# EAGLE design schematic (EAGLE 6.6.0)
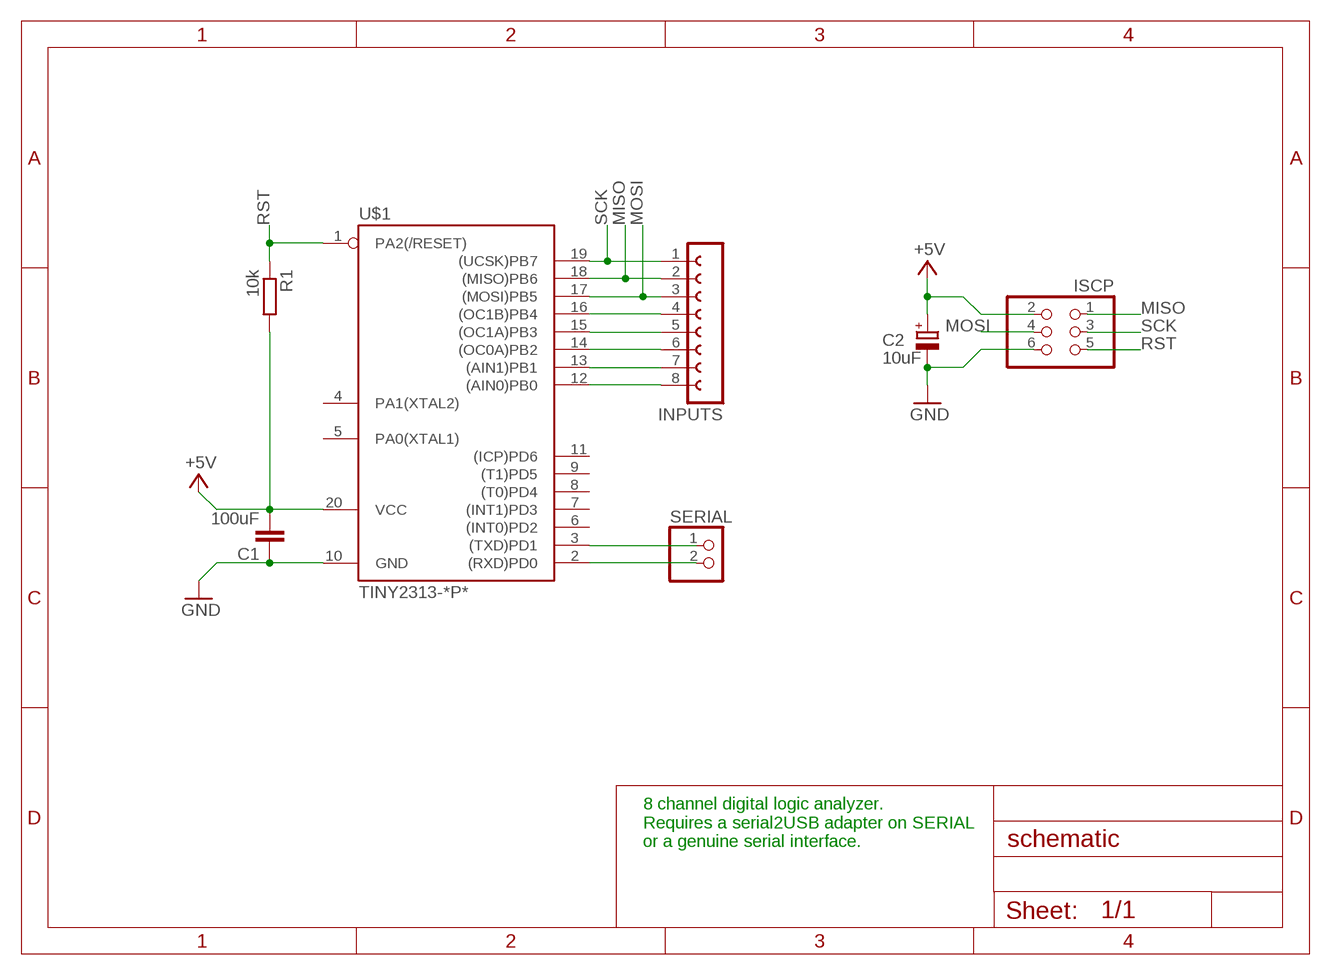
[diagram p0: schematic, sheet 1]

## Parts
C1  100uF  C-EU025-024X044  [C025-024X044]
C2  10uF  CPOL-EUE2.5-6  [E2,5-6]
INPUTS  FE08W  [FE08W]
ISCP  PINHD-2X3  [2X03]
R1  10k  R-EU_0204/2V  [0204V]
SERIAL  PINHD-1X2  [1X02]
U$1  TINY2313-*P*  [DIL20]

## Nets
+5V: C1.2 C2.+ ISCP.2 R1.2 U$1.20(VCC)
GND: C1.1 C2.- ISCP.6 U$1.10(GND)
MISO: INPUTS.2 ISCP.1 U$1.18((MISO)PB6)
MOSI: INPUTS.3 ISCP.4 U$1.17((MOSI)PB5)
N$1: SERIAL.1 U$1.3((TXD)PD1)
N$2: SERIAL.2 U$1.2((RXD)PD0)
N$4: INPUTS.4 U$1.16((OC1B)PB4)
N$5: INPUTS.5 U$1.15((OC1A)PB3)
N$6: INPUTS.6 U$1.14((OC0A)PB2)
N$7: INPUTS.7 U$1.13((AIN1)PB1)
N$8: INPUTS.8 U$1.12((AIN0)PB0)
RST: ISCP.5 R1.1 U$1.1(PA2(/RESET))
SCK: INPUTS.1 ISCP.3 U$1.19((UCSK)PB7)
Unconnected: U$1.4(PA1(XTAL2)) U$1.5(PA0(XTAL1)) U$1.6((INT0)PD2) U$1.7((INT1)PD3) U$1.8((T0)PD4) U$1.9((T1)PD5) U$1.11((ICP)PD6)

## Notes on the sheet
- 8 channel digital logic analyzer.
  Requires a serial2USB adapter on SERIAL
  or a genuine serial interface.

## Library data of the parts
C1 = rcl:C-EU: CAPACITOR, European symbol
C2 = rcl:CPOL-EU: POLARIZED CAPACITOR, European symbol
INPUTS = con-lsta:FE08W: FEMALE HEADER; OC_FARNELL: unknown; OC_NEWARK: unknown
ISCP = pinhead:PINHD-2X3: PIN HEADER
R1 = rcl:R-EU_: RESISTOR, European symbol
SERIAL = pinhead:PINHD-1X2: PIN HEADER
U$1 = avr-6:TINY2313*: Atmel Tiny2313 2K Flash, 128 bytes EEPROM, 128 bytes RAM

## Board
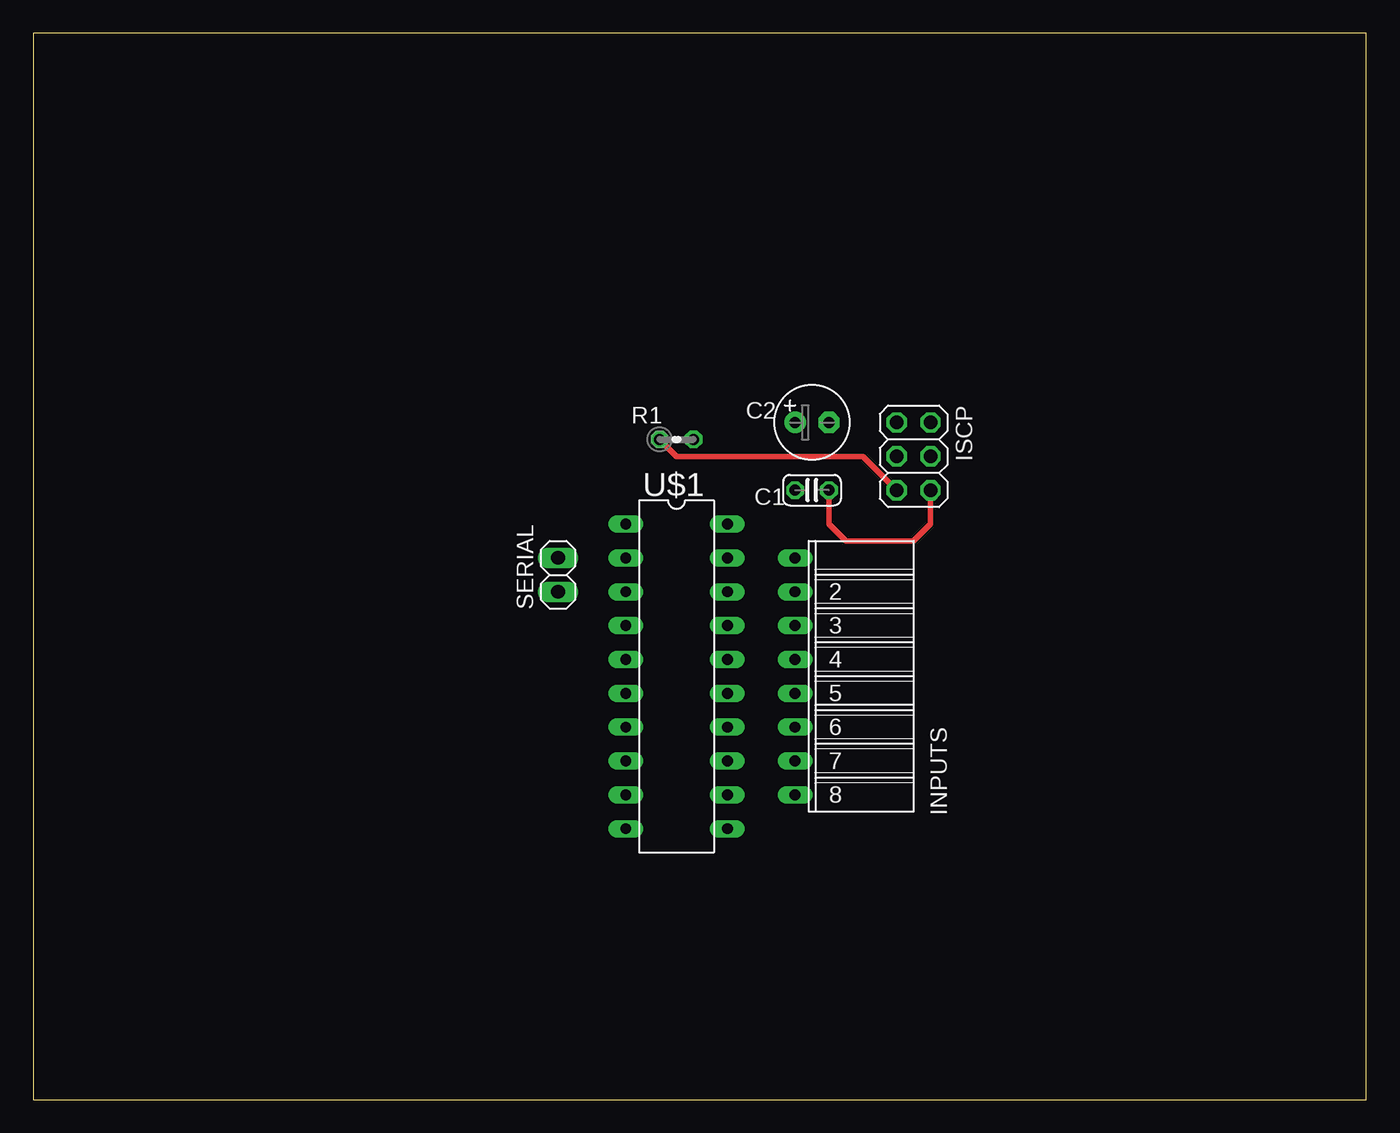
[diagram p1: board, top side]
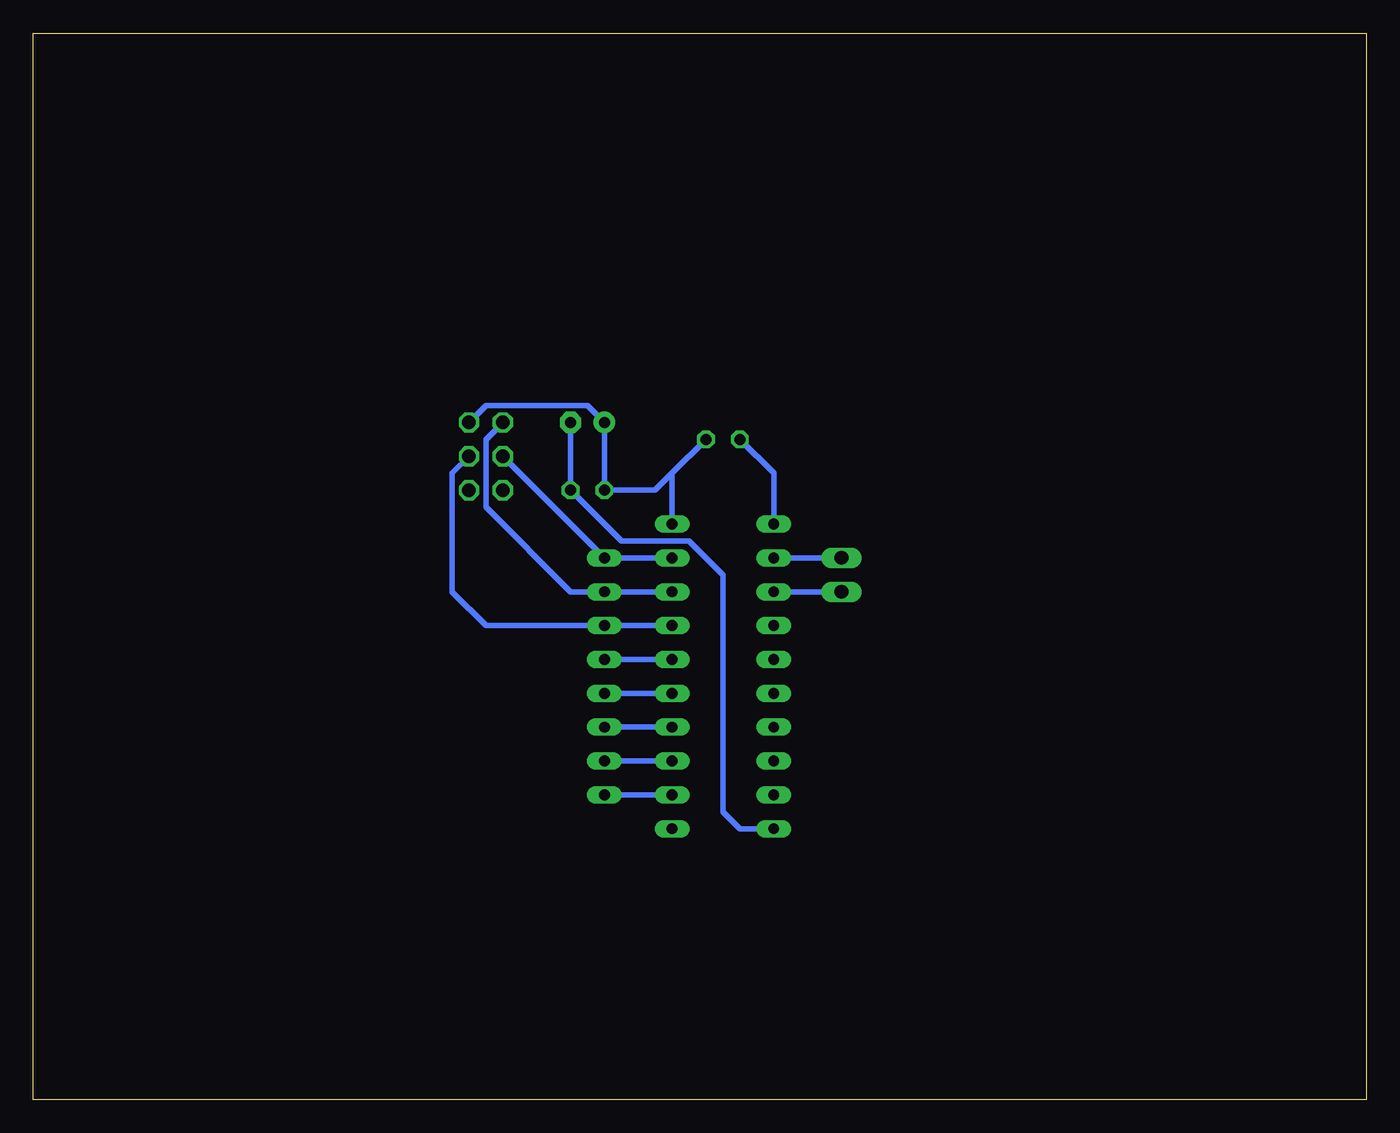
[diagram p2: board, bottom side, seen from below]

Size 100 x 80 mm. Coordinates in mm from the lower left corner, seen from the top.
Outline: 0,0 100,0 100,80 0,80 0,0
Copper layers (1*16): Top 0.035mm / dielectric 1.5mm / Bottom 0.035mm
Design rules "default": minimum track width 10mil, minimum drill 24mil, track to track 8mil, track to pad 8mil, pad to pad 8mil, via to via 8mil, smd to smd 8mil, copper to edge 40mil, drill to drill 8mil, minimum pad ring 10mil, minimum via ring 8mil, stop-mask expansion 4mil, vias tented up to drill 0mil, thermal gap 10mil

### Footprints (pad centres in the part's own frame; a part is rotated, then mirrored left to right if it is on the bottom)
C025-024X044 = drill 0.813 octagon: 1 -1.27,0; 2 1.27,0
E2,5-6 = drill 0.813 pad 1.6: + -1.27,0 | drill 0.813 pad 1.6 octagon: - 1.27,0
FE08W = drill 0.813 long: 1 -8.89,0; 2 -6.35,0; 3 -3.81,0; 4 -1.27,0; 5 1.27,0; 6 3.81,0; 7 6.35,0; 8 8.89,0
2X03 = drill 1.016 octagon: 1 -2.54,-1.27; 2 -2.54,1.27; 3 0,-1.27; 4 0,1.27; 5 2.54,-1.27; 6 2.54,1.27
0204V = drill 0.813 octagon: 1 -1.27,0; 2 1.27,0
1X02 = drill 1.016 long: 1 -1.27,0; 2 1.27,0
DIL20 = drill 0.813 long: 1 -11.43,-3.81; 2 -8.89,-3.81; 3 -6.35,-3.81; 4 -3.81,-3.81; 5 -1.27,-3.81; 6 1.27,-3.81; 7 3.81,-3.81; 8 6.35,-3.81; 9 8.89,-3.81; 10 11.43,-3.81; 11 11.43,3.81; 12 8.89,3.81; 13 6.35,3.81; 14 3.81,3.81; 15 1.27,3.81; 16 -1.27,3.81; 17 -3.81,3.81; 18 -6.35,3.81; 19 -8.89,3.81; 20 -11.43,3.81

### Placement (x,y rotation side)
C1  58.42,45.72 180 top
C2  58.42,50.8 0 top
INPUTS  57.15,31.75 270 top
ISCP  66.04,48.26 270 top
R1  48.26,49.53 0 top
SERIAL  39.37,39.37 90 top
U$1  48.26,31.75 270 top

### Tracks (layer width: path | path; a pad name or v marks a point on that pad's centre or on a via)
+5V
  Bottom 0.406: R1.2 52.07,46.99 | 52.07,46.99 U$1.20 | 52.07,46.99 53.34,45.72 C1.2 C2.+ 58.42,52.07 66.04,52.07 ISCP.2
GND
  Top 0.406: ISCP.6 67.31,43.18 66.04,41.91 60.96,41.91 59.69,43.18 C1.1
  Bottom 0.406: C2.- C1.1 55.88,41.91 50.8,41.91 48.26,39.37 48.26,21.59 46.99,20.32 U$1.10
MISO
  Bottom 0.406: U$1.18 INPUTS.2 59.69,38.1 66.04,44.45 66.04,49.53 ISCP.1
MOSI
  Bottom 0.406: U$1.17 INPUTS.3 66.04,35.56 68.58,38.1 68.58,46.99 ISCP.4
N$1
  Bottom 0.406: U$1.3 SERIAL.1
N$2
  Bottom 0.406: SERIAL.2 U$1.2
N$4
  Bottom 0.406: INPUTS.4 U$1.16
N$5
  Bottom 0.406: INPUTS.5 U$1.15
N$6
  Bottom 0.406: INPUTS.6 U$1.14
N$7
  Bottom 0.406: INPUTS.7 U$1.13
N$8
  Bottom 0.406: INPUTS.8 U$1.12
RST
  Top 0.406: ISCP.5 62.23,48.26 48.26,48.26 R1.1
  Bottom 0.406: R1.1 44.45,46.99 U$1.1
SCK
  Bottom 0.406: U$1.19 INPUTS.1 ISCP.3